# EAGLE schematic speccyboot (EAGLE 9.6.2)
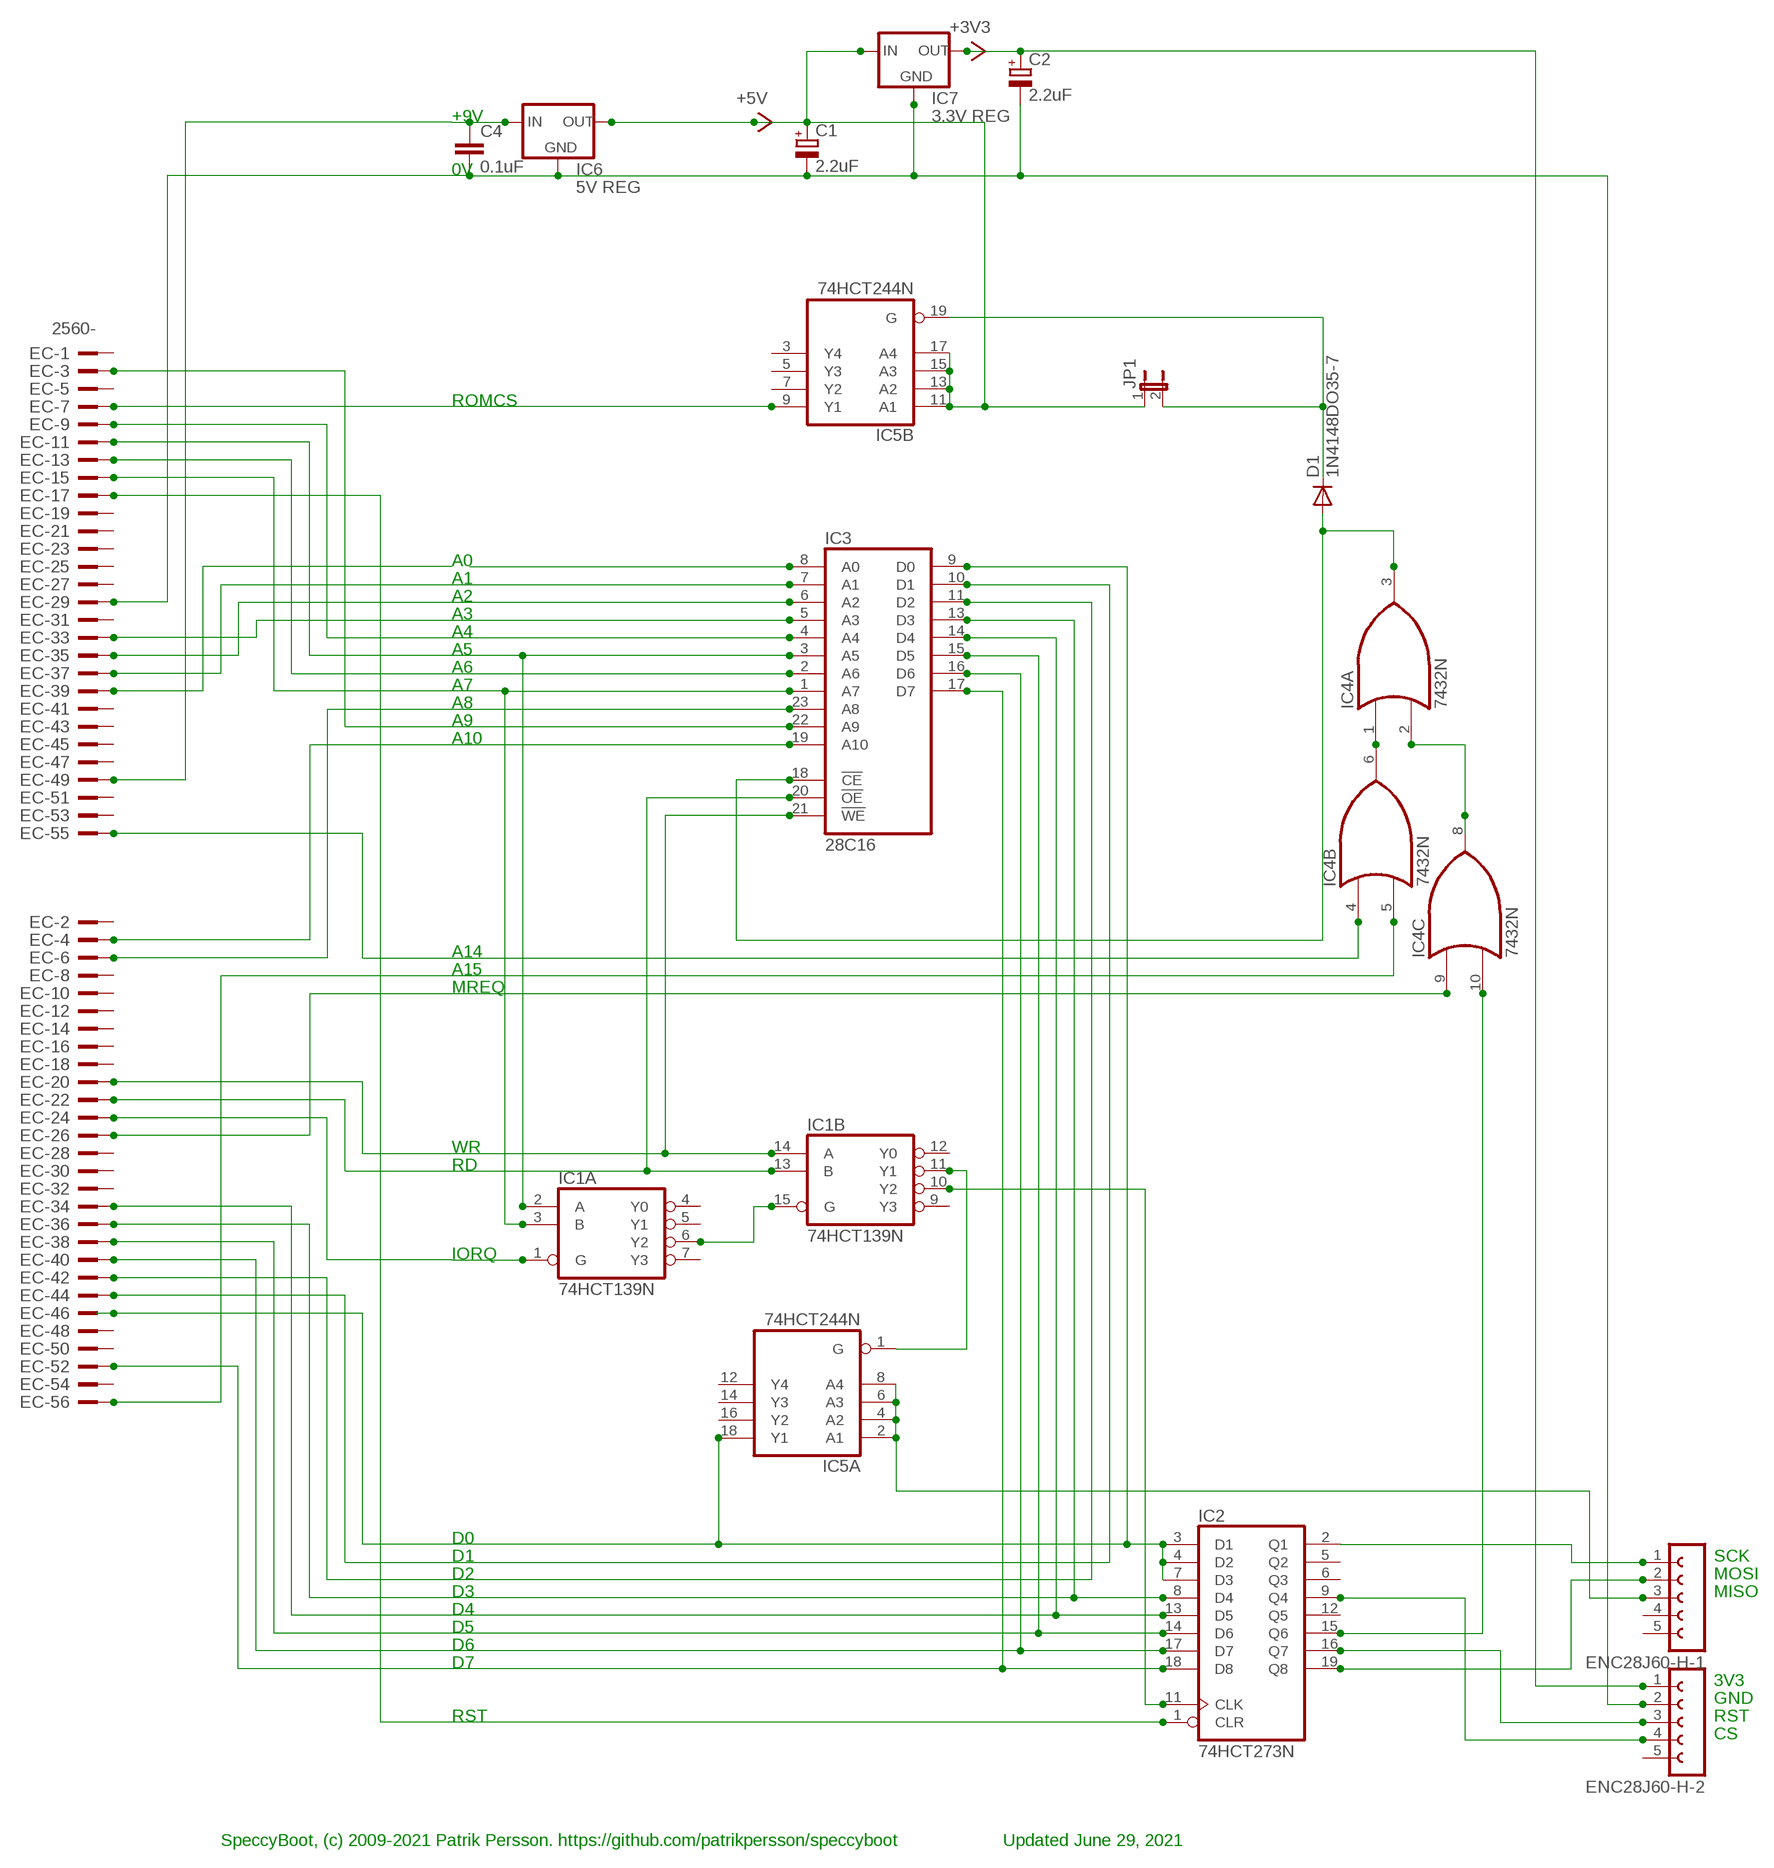
[diagram p0: schematic, sheet 1]

## Parts
C1  2.2uF  CPOL-EUE1.8-4  [E1,8-4]
C2  2.2uF  CPOL-EUE1.8-4  [E1,8-4]
C4  0.1uF  C-EU025-024X044  [C025-024X044]
D1  1N4148DO35-7  [DO35-7]
EC  2560-  [PAK100/2500-60]
ENC28J60-H-1  FE05-1  [FE05-1]
ENC28J60-H-2  FE05-1  [FE05-1]
IC1  74HCT139N  [DIL16]
IC2  74HCT273N  [DIL20]
IC3  28C16  2816  [DIL24]
IC4  7432N  [DIL14]
IC5  74HCT244N  [DIL20]
IC6  5V REG  78XXL  [78XXL]
IC7  3.3V REG  78XXL  [78XXL]
JP1  JP1E  [JP1]

## Nets
+3V3: C2.+ ENC28J60-H-2.1 IC7.OUT
N$1: D1.A IC3.18(!CE) IC4.3(A:O)
N$2: EC.17 IC2.1(CLR)
N$3: EC.52 IC2.18(D8) IC3.17(D7) IC4.8(C:O)
N$4: ENC28J60-H-1.3 IC5.2(A:A1) IC5.4(A:A2) IC5.6(A:A3) IC5.8(A:A4)
N$5: EC.38 IC2.14(D6) IC3.15(D5)
N$6: EC.34 IC2.13(D5) IC3.14(D4)
N$7: EC.36 IC2.8(D4) IC3.13(D3)
N$8: EC.40 IC2.17(D7) IC3.16(D6)
N$9: EC.24 IC1.1(A:G)
N$10: EC.46 IC2.3(D1) IC2.4(D2) IC2.7(D3) IC3.9(D0) IC5.18(A:Y1)
N$12: IC1.10(B:Y2) IC2.11(CLK)
N$13: ENC28J60-H-2.4 IC2.9(Q4)
N$14: ENC28J60-H-2.3 IC2.16(Q7)
N$15: EC.42 IC3.11(D2)
N$16: EC.44 IC3.10(D1)
N$17: IC3.8(A0)
N$18: EC.37 IC3.7(A1)
N$19: EC.35 IC3.6(A2)
N$20: EC.33 IC3.5(A3)
N$21: EC.9 IC3.4(A4)
N$22: EC.11 IC1.2(A:A) IC3.3(A5)
N$23: EC.13 IC3.2(A6)
N$24: EC.15 IC1.3(A:B) IC3.1(A7)
N$25: EC.6 IC3.23(A8)
N$26: EC.3 IC3.22(A9)
N$27: EC.4 IC3.19(A10)
N$30: ENC28J60-H-1.1 IC2.2(Q1)
N$31: EC.39
N$32: ENC28J60-H-1.2 IC2.19(Q8)
N$33: C1.- C2.- C4.2 EC.29 ENC28J60-H-2.2 IC6.GND IC7.GND
N$34: IC1.6(A:Y2) IC1.15(B:G)
N$35: EC.7 IC5.9(B:Y1)
N$36: IC4.2(A:I1)
N$37: D1.C IC5.19(B:G) JP1.2
N$38: EC.20 IC1.14(B:A) IC3.21(!WE)
N$39: IC1.11(B:Y1) IC5.1(A:G)
N$40: C4.1 EC.49 IC6.IN
N$44: EC.26 IC4.9(C:I0)
N$45: EC.55 IC4.4(B:I0)
N$46: IC4.1(A:I0) IC4.6(B:O)
N$47: EC.56 IC4.5(B:I1)
N$48: IC2.15(Q6) IC4.10(C:I1)
N$49: C1.+ IC5.11(B:A1) IC5.13(B:A2) IC5.15(B:A3) IC5.17(B:A4) IC7.IN JP1.1 ; supply symbol labelled +5V
N$50: IC6.OUT
N$51: EC.22 IC1.13(B:B) IC3.20(!OE)
Unconnected: EC.1 EC.2 EC.5 EC.8 EC.10 EC.12 EC.14 EC.16 EC.18 EC.19 EC.21 EC.23 EC.25 EC.27 EC.28 EC.30 EC.31 EC.32 EC.41 EC.43 EC.45 EC.47 EC.48 EC.50 EC.51 EC.53 EC.54 EC.57 EC.58 EC.59 EC.60 ENC28J60-H-1.4 ENC28J60-H-1.5 ENC28J60-H-2.5 IC1.4(A:Y0) IC1.5(A:Y1) IC1.7(A:Y3) IC1.9(B:Y3) IC1.12(B:Y0) IC2.5(Q2) IC2.6(Q3) IC2.12(Q5) IC4.11(D:O) IC4.12(D:I0) IC4.13(D:I1) IC5.3(B:Y4) IC5.5(B:Y3) IC5.7(B:Y2) IC5.12(A:Y4) IC5.14(A:Y3) IC5.16(A:Y2)

## Notes on the sheet
- +9V
- 0V
- ROMCS
- A0
- A1
- A2
- A3
- A4
- A5
- A6
- A7
- A8
- A9
- A10
- A14
- A15
- MREQ
- WR
- RD
- IORQ
- D0
- D1 | SCK
- D2 | MOSI
- D3 | MISO
- D4
- D5
- D6
- D7
- 3V3
- GND
- RST | RST
- CS
- SpeccyBoot, (c) 2009-2021 Patrik Persson. https://github.com/patrikpersson/speccyboot | Updated June 29, 2021

## Power pins joined to a net without a drawn wire
GND: IC1.8(P:GND) IC2.10(GND) IC3.12(GND) IC4.7(P:GND) IC5.10(P:GND)
VCC: IC1.16(P:VCC) IC2.20(VCC) IC3.24(VCC) IC4.14(P:VCC) IC5.20(P:VCC)

## Library data of the parts
C1 C2 = resistor:CPOL-EU: POLARIZED CAPACITOR, European symbol
C4 = resistor:C-EU: CAPACITOR, European symbol
D1 = diode:1N4148: DIODE high speed (Philips)
EC = con-3m:2560-: 3M (TM) Pak 100 4-Wall Header Source: 3M
ENC28J60-H-1 ENC28J60-H-2 = con-lsta:FE05-1: FEMALE HEADER
IC1 = 74xx-eu:74*139: Dual 2-line to 4-line DECODER/DEMULTIPLEXER
IC2 = 74xx-eu:74*273: Octal D type FLIP FLOP, clear
IC3 = memory:2816: MEMORY
IC4 = 74xx-us:74*32: Quad 2-input OR gate
IC5 = 74xx-eu:74*244: Octal BUFFER and LINE DRIVER, 3-state
IC6 IC7 = v-reg:78XXL: VOLTAGE REGULATOR
JP1 = jumper:JP1E: JUMPER